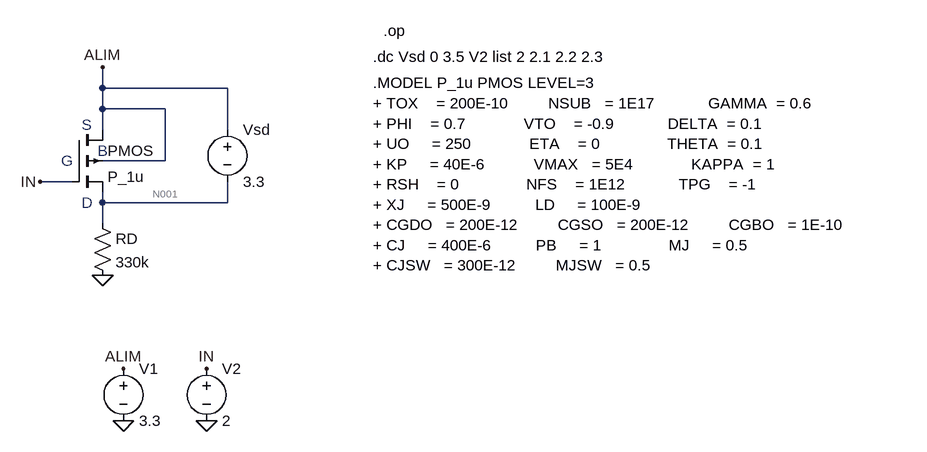
[diagram p0: schematic Courant.asc]
Courant.asc, the LTspice schematic file:
Version 4
SHEET 1 1412 680
WIRE 144 64 144 32
WIRE 336 64 144 64
WIRE 144 96 144 64
WIRE 240 96 144 96
WIRE 144 128 144 96
WIRE 336 128 336 64
WIRE 240 176 240 96
WIRE 240 176 144 176
WIRE 96 208 48 208
WIRE 144 240 144 224
WIRE 336 240 336 208
WIRE 336 240 144 240
WIRE 144 272 144 240
FLAG 144 352 0
FLAG 144 32 ALIM
FLAG 48 208 IN
FLAG 176 496 ALIM
FLAG 304 496 IN
FLAG 304 576 0
FLAG 176 576 0
SYMBOL pmos4 96 128 R0
SYMATTR InstName PMOS
SYMATTR Value P_1u
SYMATTR Value2 l=1u w=2.5u
SYMBOL res 128 256 R0
SYMATTR InstName RD
SYMATTR Value 330k
SYMBOL voltage 336 112 R0
WINDOW 123 0 0 Left 0
WINDOW 39 0 0 Left 0
SYMATTR InstName Vsd
SYMATTR Value 3.3
SYMBOL voltage 176 480 R0
WINDOW 123 0 0 Left 0
WINDOW 39 0 0 Left 0
SYMATTR InstName V1
SYMATTR Value 3.3
SYMBOL voltage 304 480 R0
WINDOW 123 0 0 Left 0
WINDOW 39 0 0 Left 0
SYMATTR InstName V2
SYMATTR Value 2
TEXT 560 56 Left 2 !.MODEL P_1u PMOS LEVEL=3\n+ TOX    = 200E-10         NSUB   = 1E17            GAMMA  = 0.6          \n+ PHI    = 0.7             VTO    = -0.9            DELTA  = 0.1          \n+ UO     = 250             ETA    = 0               THETA  = 0.1         \n+ KP     = 40E-6           VMAX   = 5E4             KAPPA  = 1         \n+ RSH    = 0               NFS    = 1E12            TPG    = -1                 \n+ XJ     = 500E-9          LD     = 100E-9               \n+ CGDO   = 200E-12         CGSO   = 200E-12         CGBO   = 1E-10              \n+ CJ     = 400E-6          PB     = 1               MJ     = 0.5                \n+ CJSW   = 300E-12         MJSW   = 0.5
TEXT 112 120 Left 2 ;S
TEXT 560 16 Left 2 !.dc Vsd 0 3.5 V2 list 2 2.1 2.2 2.3
TEXT 576 -24 Left 2 !.op
TEXT 112 240 Left 2 ;D
TEXT 80 176 Left 2 ;G
TEXT 136 160 Left 2 ;B

The netlist it stands for:
* Courant.asc
M§PMOS ALIM IN N001 ALIM P_1u l=1u w=2.5u
RD N001 0 330k
Vsd ALIM N001 3.3
V1 ALIM 0 3.3
V2 IN 0 2
.model NMOS NMOS
.model PMOS PMOS
.lib standard.mos
.MODEL P_1u PMOS LEVEL=3
+ TOX    = 200E-10         NSUB   = 1E17            GAMMA  = 0.6
+ PHI    = 0.7             VTO    = -0.9            DELTA  = 0.1
+ UO     = 250             ETA    = 0               THETA  = 0.1
+ KP     = 40E-6           VMAX   = 5E4             KAPPA  = 1
+ RSH    = 0               NFS    = 1E12            TPG    = -1
+ XJ     = 500E-9          LD     = 100E-9
+ CGDO   = 200E-12         CGSO   = 200E-12         CGBO   = 1E-10
+ CJ     = 400E-6          PB     = 1               MJ     = 0.5
+ CJSW   = 300E-12         MJSW   = 0.5
* S
.dc Vsd 0 3.5 V2 list 2 2.1 2.2 2.3
.op
* D
* G
* B
.backanno
.end

* Results of the author's LTspice run, read from the files saved beside the schematic
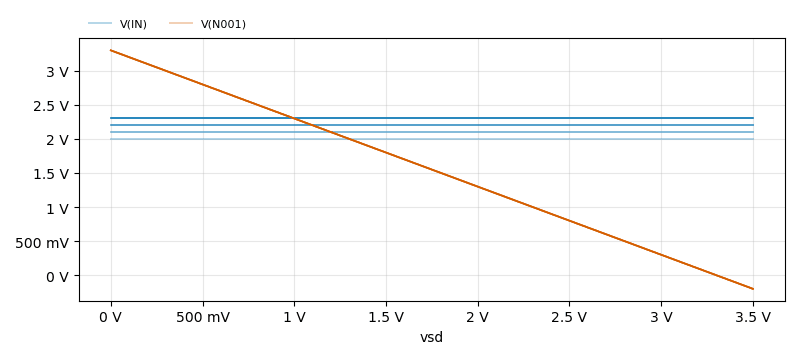
[diagram p1: DC transfer characteristic of Courant.asc, plotted from the saved traces]
* DC transfer characteristic, 4 runs:
*   V(IN) [v2=2]: 2 V at vsd=0 V, 2 V at vsd=3.5 V, min 2 V, max 2 V
*   V(IN) [v2=2.1]: 2.1 V at vsd=0 V, 2.1 V at vsd=3.5 V, min 2.1 V, max 2.1 V
*   V(IN) [v2=2.2]: 2.2 V at vsd=0 V, 2.2 V at vsd=3.5 V, min 2.2 V, max 2.2 V
*   V(IN) [v2=2.3]: 2.3 V at vsd=0 V, 2.3 V at vsd=3.5 V, min 2.3 V, max 2.3 V
*   V(N001) [v2=2]: 3.3 V at vsd=0 V, -200 mV at vsd=3.5 V, min -200 mV, max 3.3 V
*   V(N001) [v2=2.1]: 3.3 V at vsd=0 V, -200 mV at vsd=3.5 V, min -200 mV, max 3.3 V
*   V(N001) [v2=2.2]: 3.3 V at vsd=0 V, -200 mV at vsd=3.5 V, min -200 mV, max 3.3 V
*   V(N001) [v2=2.3]: 3.3 V at vsd=0 V, -200 mV at vsd=3.5 V, min -200 mV, max 3.3 V